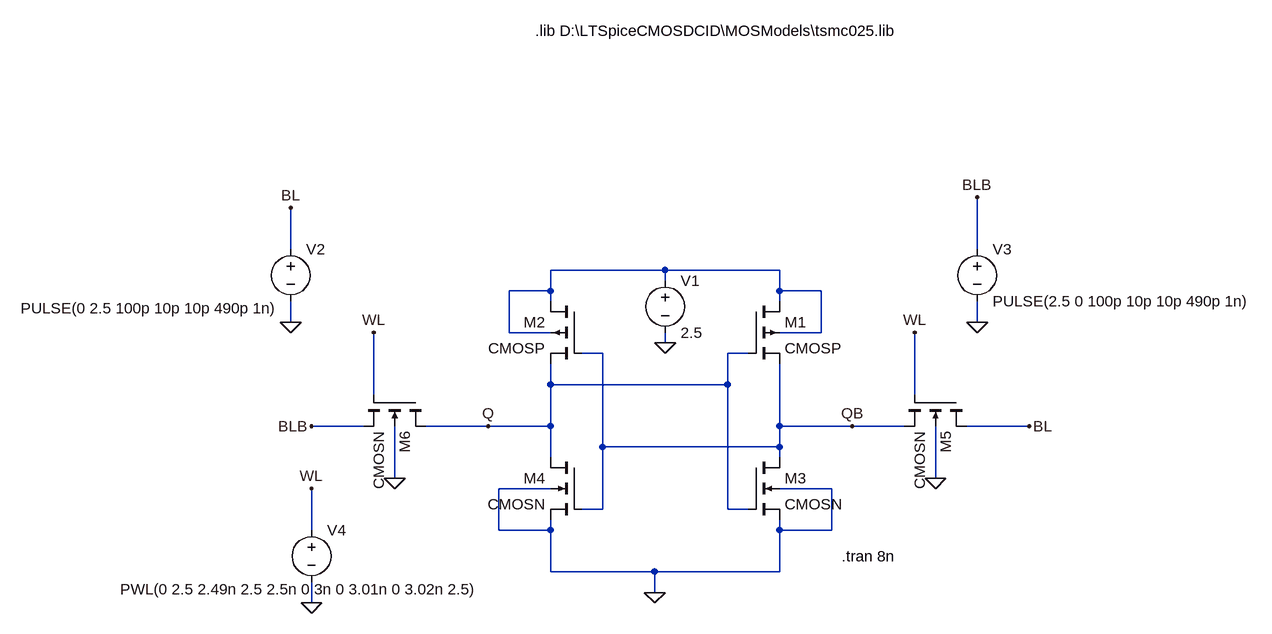
[diagram p0: schematic sram.asc]
sram.asc, the LTspice schematic file:
Version 4
SHEET 1 1636 4668
WIRE -384 -16 -384 -80
WIRE 672 -16 672 -96
WIRE 192 16 16 16
WIRE 368 16 192 16
WIRE 192 32 192 16
WIRE 16 48 16 16
WIRE 16 48 -48 48
WIRE 368 48 368 16
WIRE 432 48 368 48
WIRE 16 64 16 48
WIRE 368 64 368 48
WIRE -384 96 -384 64
WIRE 672 96 672 64
WIRE -48 112 -48 48
WIRE 16 112 -48 112
WIRE 432 112 432 48
WIRE 432 112 368 112
WIRE 192 128 192 112
WIRE 96 144 64 144
WIRE 320 144 288 144
WIRE 16 192 16 160
WIRE 288 192 288 144
WIRE 288 192 16 192
WIRE -256 208 -256 112
WIRE 576 208 576 112
WIRE -272 256 -352 256
WIRE -80 256 -176 256
WIRE 16 256 16 192
WIRE 16 256 -80 256
WIRE 368 256 368 160
WIRE 480 256 368 256
WIRE 560 256 480 256
WIRE 752 256 656 256
WIRE 96 288 96 144
WIRE 368 288 368 256
WIRE 368 288 96 288
WIRE 16 304 16 256
WIRE 368 304 368 288
WIRE -224 336 -224 256
WIRE 608 336 608 256
WIRE 16 352 -64 352
WIRE 448 352 368 352
WIRE 96 384 96 288
WIRE 96 384 64 384
WIRE 288 384 288 192
WIRE 320 384 288 384
WIRE -352 416 -352 352
WIRE -64 416 -64 352
WIRE 16 416 16 400
WIRE 16 416 -64 416
WIRE 368 416 368 400
WIRE 448 416 448 352
WIRE 448 416 368 416
WIRE 16 480 16 416
WIRE 176 480 16 480
WIRE 368 480 368 416
WIRE 368 480 176 480
WIRE 176 512 176 480
WIRE -352 528 -352 496
FLAG 176 512 0
FLAG -224 336 0
FLAG 608 336 0
FLAG 192 128 0
FLAG -384 96 0
FLAG -352 528 0
FLAG 672 96 0
FLAG -80 256 Q
FLAG 480 256 QB
FLAG 576 112 WL
FLAG -256 112 WL
FLAG 752 256 BL
FLAG -352 256 BLB
FLAG -352 352 WL
FLAG -384 -80 BL
FLAG 672 -96 BLB
SYMBOL cmosp 320 64 R0
SYMATTR InstName M1
SYMATTR Value2 l=250n w=360n ad=0.1728p as=0.1728p pd=1680n ps=1680n
SYMBOL cmosp 64 64 M0
SYMATTR InstName M2
SYMATTR Value2 l=250n w=360n ad=0.1728p as=0.1728p pd=1680n ps=1680n
SYMBOL cmosn 320 304 R0
SYMATTR InstName M3
SYMATTR Value2 l=250n w=360n ad=0.1728p as=0.1728p pd=1680n ps=1680n
SYMBOL cmosn 64 304 M0
SYMATTR InstName M4
SYMATTR Value2 l=250n w=360n ad=0.1728p as=0.1728p pd=1680n ps=1680n
SYMBOL cmosn 656 208 R90
SYMATTR InstName M5
SYMATTR Value2 l=250n w=360n ad=0.1728p as=0.1728p pd=1680n ps=1680n
SYMBOL cmosn -176 208 R90
SYMATTR InstName M6
SYMATTR Value2 l=250n w=360n ad=0.1728p as=0.1728p pd=1680n ps=1680n
SYMBOL voltage 192 16 R0
WINDOW 123 0 0 Left 0
WINDOW 39 0 0 Left 0
SYMATTR InstName V1
SYMATTR Value 2.5
SYMBOL voltage -384 -32 R0
WINDOW 3 -17 107 Right 2
WINDOW 123 0 0 Left 0
WINDOW 39 0 0 Left 0
SYMATTR Value PULSE(0 2.5 100p 10p 10p 490p 1n)
SYMATTR InstName V2
SYMBOL voltage 672 -32 R0
WINDOW 123 0 0 Left 0
WINDOW 39 0 0 Left 0
SYMATTR InstName V3
SYMATTR Value PULSE(2.5 0 100p 10p 10p 490p 1n)
SYMBOL voltage -352 400 R0
WINDOW 3 260 107 Right 2
WINDOW 123 0 0 Left 0
WINDOW 39 0 0 Left 0
SYMATTR Value PWL(0 2.5 2.49n 2.5 2.5n 0 3n 0 3.01n 0 3.02n 2.5)
SYMATTR InstName V4
TEXT -8 -352 Left 2 !.lib D:\\LTSpiceCMOSDCID\\MOSModels\\tsmc025.lib
TEXT 464 456 Left 2 !.tran 8n

The netlist it stands for:
* sram.asc
M1 N001 Q QB N001 CMOSP l=250n w=360n ad=0.1728p as=0.1728p pd=1680n ps=1680n
M2 N001 QB Q N001 CMOSP l=250n w=360n ad=0.1728p as=0.1728p pd=1680n ps=1680n
M3 QB Q 0 0 CMOSN l=250n w=360n ad=0.1728p as=0.1728p pd=1680n ps=1680n
M4 Q QB 0 0 CMOSN l=250n w=360n ad=0.1728p as=0.1728p pd=1680n ps=1680n
M5 BL WL QB 0 CMOSN l=250n w=360n ad=0.1728p as=0.1728p pd=1680n ps=1680n
M6 Q WL BLB 0 CMOSN l=250n w=360n ad=0.1728p as=0.1728p pd=1680n ps=1680n
V1 N001 0 2.5
V2 BL 0 PULSE(0 2.5 100p 10p 10p 490p 1n)
V3 BLB 0 PULSE(2.5 0 100p 10p 10p 490p 1n)
V4 WL 0 PWL(0 2.5 2.49n 2.5 2.5n 0 3n 0 3.01n 0 3.02n 2.5)
.model NMOS NMOS
.model PMOS PMOS
.lib standard.mos
.lib D:\LTSpiceCMOSDCID\MOSModels\tsmc025.lib
.tran 8n
.backanno
.end

* Results of the author's LTspice run, read from the files saved beside the schematic
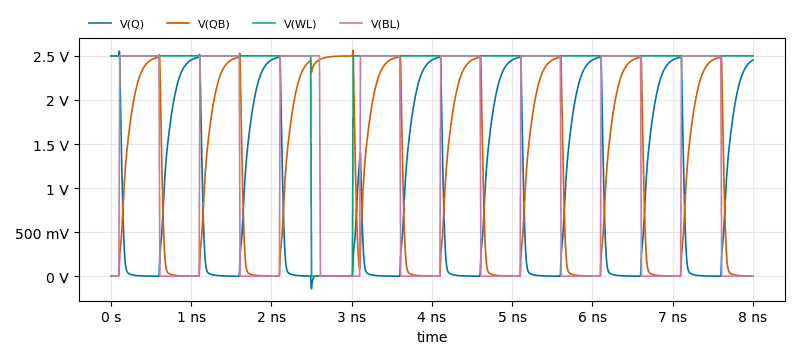
[diagram p1: Transient Analysis of sram.asc, plotted from the saved traces]
* Transient Analysis, 1 run:
*   V(Q): min -142.9 mV, max 2.554 V, average 949.2 mV, rms 1.412 V, last 2.453 V
*   V(QB): min -709.9 µV, max 2.563 V, average 1.201 V, rms 1.61 V, last 1.06 mV
*   V(WL): min 0 V, max 2.5 V, average 2.337 V, rms 2.417 V, last 2.5 V
*   V(BL): min 0 V, max 2.5 V, average 1.25 V, rms 1.763 V, last 0 V